# Altium schematic sheet Sheet_Soldering_Iron.SchDoc
size A4
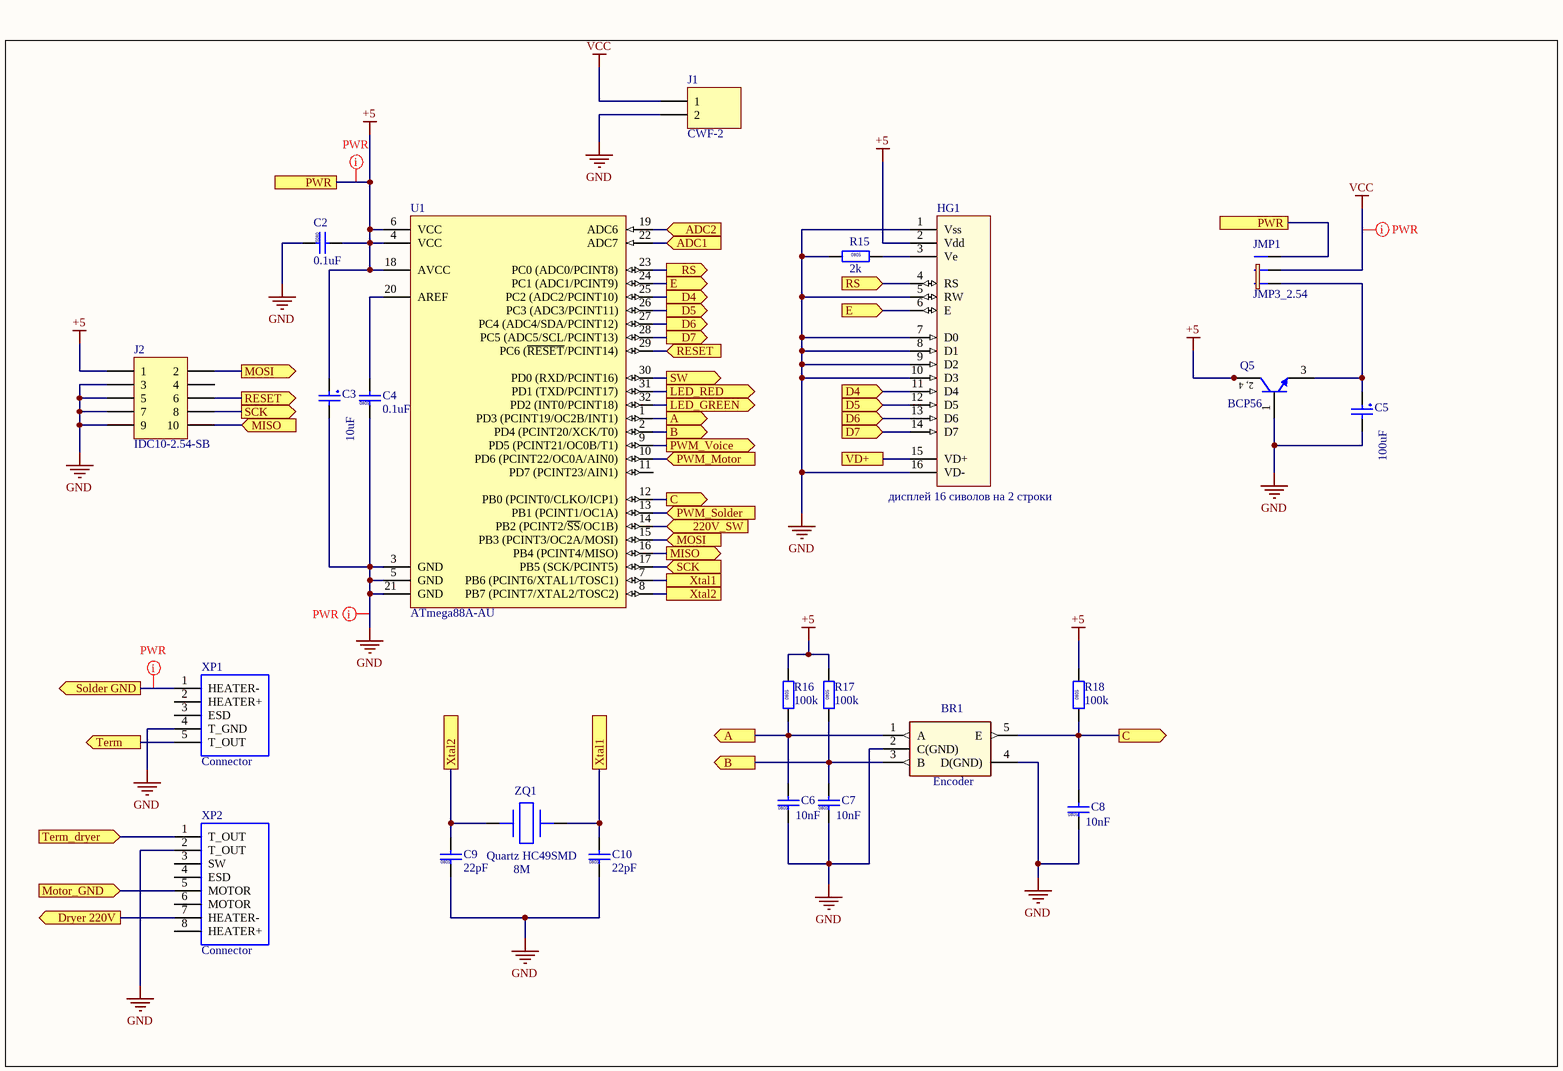
[diagram p0: Sheet_Soldering_Iron.SchDoc]

## Parts
BR1  Encoder  [PCBComponent_1]
C2  value 0.1uF  [CAPC2012-0805M]  (hidden comment: CAPC_0805)
C3  value 10uF  [ECAP511]  (hidden comment: ECAP-511)
C4  value 0.1uF  [CAPC2012-0805M]  (hidden comment: CAPC_0805)
C5  value 100uF  [ECAP511]  (hidden comment: ECAP-511)
C6  value 10nF  [CAPC2012-0805M]  (hidden comment: CAPC_0805)
C7  value 10nF  [CAPC2012-0805M]  (hidden comment: CAPC_0805)
C8  value 10nF  [CAPC2012-0805M]  (hidden comment: CAPC_0805)
C9  value 22pF  [CAPC2012-0805M]  (hidden comment: CAPC_0805)
C10  value 22pF  [CAPC2012-0805M]  (hidden comment: CAPC_0805)
HG1  дисплей 16 сиволов на 2 строки  [PCBComponent_1]
J1  CWF-2  [CWF-2]
J2  IDC10-2.54-SB  [IDC10-2.54-SB]
JMP1  JMP3_2.54  [JMP3_2.54]
Q5  BCP56  [SOT223_N]
R15  value 2k  [RESC2012-0805M]  (hidden comment: RESC_0805_R)
R16  value 100k  [RESC2012-0805M]  (hidden comment: RESC_0805_R)
R17  value 100k  [RESC2012-0805M]  (hidden comment: RESC_0805_R)
R18  value 100k  [RESC2012-0805M]  (hidden comment: RESC_0805_R)
U1  ATmega88A-AU  [32A_N]
XP1  Connector  [PCBComponent_1]
XP2  Connector  [PCBComponent_1]
ZQ1  Quartz HC49SMD  value 8M  [HC-49SMD]

## Ports
220V_SW (in), A (out), ADC1 (in), ADC2 (in), B (out), C (out), D4 (in), D4 (out), D5 (in), D5 (out), D6 (in), D6 (out), D7 (in), D7 (out), Dryer 220V (out), E (in), E (out), LED_GREEN (out), LED_RED (out), MISO (in), MISO (out), MOSI (in), MOSI (out), Motor_GND (in), PWM_Motor (in), PWM_Solder (in), PWM_Voice (out), PWR, RESET (in), RESET (out), RS (in), RS (out), SCK (in), SCK (out), Solder GND (out), SW (out), Term (out), Term_dryer (in), VD+, Xtal1, Xtal2

## Nets
+5: C2.2 C3.1 HG1.2(Vdd) J2.1 JMP1.3 Q5.2(C) Q5.4(C) R16.2 R17.2 R18.2 U1.4(VCC) U1.6(VCC) U1.18(AVCC) ; port PWR
GND: BR1.2(C(GND)) BR1.4(D(GND)) C2.1 C3.2 C4.1 C5.2 C6.1 C7.1 C8.1 C9.1 C10.1 HG1.1(Vss) HG1.5(RW) HG1.7(D0) HG1.8(D1) HG1.9(D2) HG1.10(D3) HG1.16(VD-) J1.2 J2.3 J2.5 J2.7 J2.9 Q5.1(B) R15.1 U1.3(GND) U1.5(GND) U1.21(GND) XP1.4(T_GND) XP2.2(T_OUT)
VCC: J1.1 JMP1.2
220V_SW: U1.14(PB2_(PCINT2/~{SS}/OC1B)) ; port 220V_SW
A: BR1.1(A) C6.2 R16.1 U1.1(PD3_(PCINT19/OC2B/INT1)) ; port A
ADC1: U1.22(ADC7) ; port ADC1
ADC2: U1.19(ADC6) ; port ADC2
B: BR1.3(B) C7.2 R17.1 U1.2(PD4_(PCINT20/XCK/T0)) ; port B
C: BR1.5(E) C8.2 R18.1 U1.12(PB0_(PCINT0/CLKO/ICP1)) ; port C
D4: HG1.11(D4) U1.25(PC2_(ADC2/PCINT10)) ; port D4
D5: HG1.12(D5) U1.26(PC3_(ADC3/PCINT11)) ; port D5
D6: HG1.13(D6) U1.27(PC4_(ADC4/SDA/PCINT12)) ; port D6
D7: HG1.14(D7) U1.28(PC5_(ADC5/SCL/PCINT13)) ; port D7
Dryer 220V: XP2.7(HEATER-) ; port Dryer 220V
E: HG1.6(E) U1.24(PC1_(ADC1/PCINT9)) ; port E
LED_GREEN: U1.32(PD2_(INT0/PCINT18)) ; port LED_GREEN
LED_RED: U1.31(PD1_(TXD/PCINT17)) ; port LED_RED
MISO: J2.10 U1.16(PB4_(PCINT4/MISO)) ; port MISO
MOSI: J2.2 U1.15(PB3_(PCINT3/OC2A/MOSI)) ; port MOSI
Motor_GND: XP2.5(MOTOR) ; port Motor_GND
PWM_Motor: U1.10(PD6_(PCINT22/OC0A/AIN0)) ; port PWM_Motor
PWM_Solder: U1.13(PB1_(PCINT1/OC1A)) ; port PWM_Solder
PWM_Voice: U1.9(PD5_(PCINT21/OC0B/T1)) ; port PWM_Voice
RESET: J2.6 U1.29(PC6_(~{RESET}/PCINT14)) ; port RESET
RS: HG1.4(RS) U1.23(PC0_(ADC0/PCINT8)) ; port RS
SCK: J2.8 U1.17(PB5_(SCK/PCINT5)) ; port SCK
Solder GND: XP1.1(HEATER-) ; port Solder GND
SW: U1.30(PD0_(RXD/PCINT16)) ; port SW
Term: XP1.5(T_OUT) ; port Term
Term_dryer: XP2.1(T_OUT) ; port Term_dryer
VD+: HG1.15(VD+) ; port VD+
Xtal1: C10.2 U1.7(PB6_(PCINT6/XTAL1/TOSC1)) ZQ1.2 ; port Xtal1
Xtal2: C9.2 U1.8(PB7_(PCINT7/XTAL2/TOSC2)) ZQ1.1 ; port Xtal2
NetC4_2: C4.2 U1.20(AREF)
NetC5_1: C5.1 JMP1.1 Q5.3(E)
NetHG1_3: HG1.3(Ve) R15.2

Not connected (* = marked no-connect by the designer): J2 4; U1 11(PD7_(PCINT23/AIN1)); XP1 2(HEATER+) 3(ESD); XP2 3(SW) 4(ESD) 6(MOTOR) 8(HEATER+)

## Layout directives
net class PWR; rule Width Constraint [Pref Width = 2mm    Min Width = 1mm    Max Width = 5mm]; rule Clearance Constraint [Clearance = 0.125mm]: Solder GND
mark named PWR: +5, GND, VCC

## Notes on the sheet
- (in symbol BCP56) 2, 4
- (in symbol CAPC_0805) 0805
- (in symbol RESC_0805_R) 0805

## Library data of the parts
BR1 = EC11: Энкодер с кнопкой
C2 C4 C6-C10 = CAPC_0805: Capacitor 0805
C3 C5 = ECAP-511: Capacitor electrolytic 2.5 mm pitch, 5*11 body
HG1 = LCD1602: HelpURL: https://cdn-shop.adafruit.com/datasheets/TC1602A-01T.pdf
J2 = IDC10-2.54-SB: IDC10 2.54 mm pitch Straight, plastic Box; LatestRevisionDate: 17-Jul-2002; LatestRevisionNote: Re-released for DXP Platform.; Publisher: Altium Limited
JMP1 = JMP3_2.54: 2.54mm 3-pin "switching" jumper
Q5 = BCP56: NPN Medium Power Transistor; Published: 17-Sep-2003; LatestRevisionDate: 12-Dec-2006; LatestRevisionNote: IPC-7351 Footprint Added.; DatasheetVersion: 10-Oct-2001; PackageVersion: Aug-2001; PackageReference: SOT223; Publisher: Altium Limited; PackageDescription: 4-Pin SOT-223 Package 2.3 mm Pitch, 7 mm Lead Span; ComponentLink1Description: Manufacturer Link; ComponentLink1URL: http://www.semiconductors.philips.com/; ComponentLink2Description: Datasheet; ComponentLink2URL: http://www.semiconductors.philips.com/acrobat/datasheets/BC639_BCP56_BCX56_7.pdf
R15-R18 = RESC_0805_R: Resistor 0805
U1 = ATmega88A-AU: 8-bit AVR Microcontroller, 8KB Flash, 512 Bytes EEPROM, 1KB SRAM, 32-pin TQFP, Industrial Grade (-40°C to 85°C); Published: 1-Apr-2010; DatasheetVersion: revA, Jan-2010; PackageVersion: revB, Oct-2001; PackageReference: 32A; Publisher: Altium Limited; PackageDescription: 32-Lead, 7x7x1.0 mm Body, 0.8mm Lead Pitch, Thin Profile Plastic Quad Flat Package (TQFP); Supplier 1: Digi-Key; Supplier Part Number 1: ATMEGA88A-AU-ND; Supplier 2: Mouser; Supplier Part Number 2: 556-ATMEGA88A-AU; Code_JEDEC: MS-026-ABA; ComponentLink1Description: Manufacturer Link; ComponentLink1URL: http://www.atmel.com/products/avr/default.asp?; ComponentLink2Description: ATmega48A/48PA/88A/88PA/168A/168PA/328/328P Datasheet; ComponentLink2URL: http://www.atmel.com/dyn/resources/prod_documents/8271.pdf; ComponentLink3Description: ATmega48A/48PA/88A/88PA/168A/168PA/328/328P Summary; ComponentLink3URL: http://www.atmel.com/dyn/resources/prod_documents/8271S.pdf; ComponentLink4Description: Atmel.com Home; ComponentLink4URL: http://www.atmel.com
XP1 = GX16-5: Разъём с 5 контактами типа мама
XP2 = GX16-8: Разъём с 8 контактами типа мама